# Altium schematic sheet 10_NTC_TEMPSENSOR.SchDoc
size 420 x 297 mm; SheetNumber: 17; SheetTotal: 28
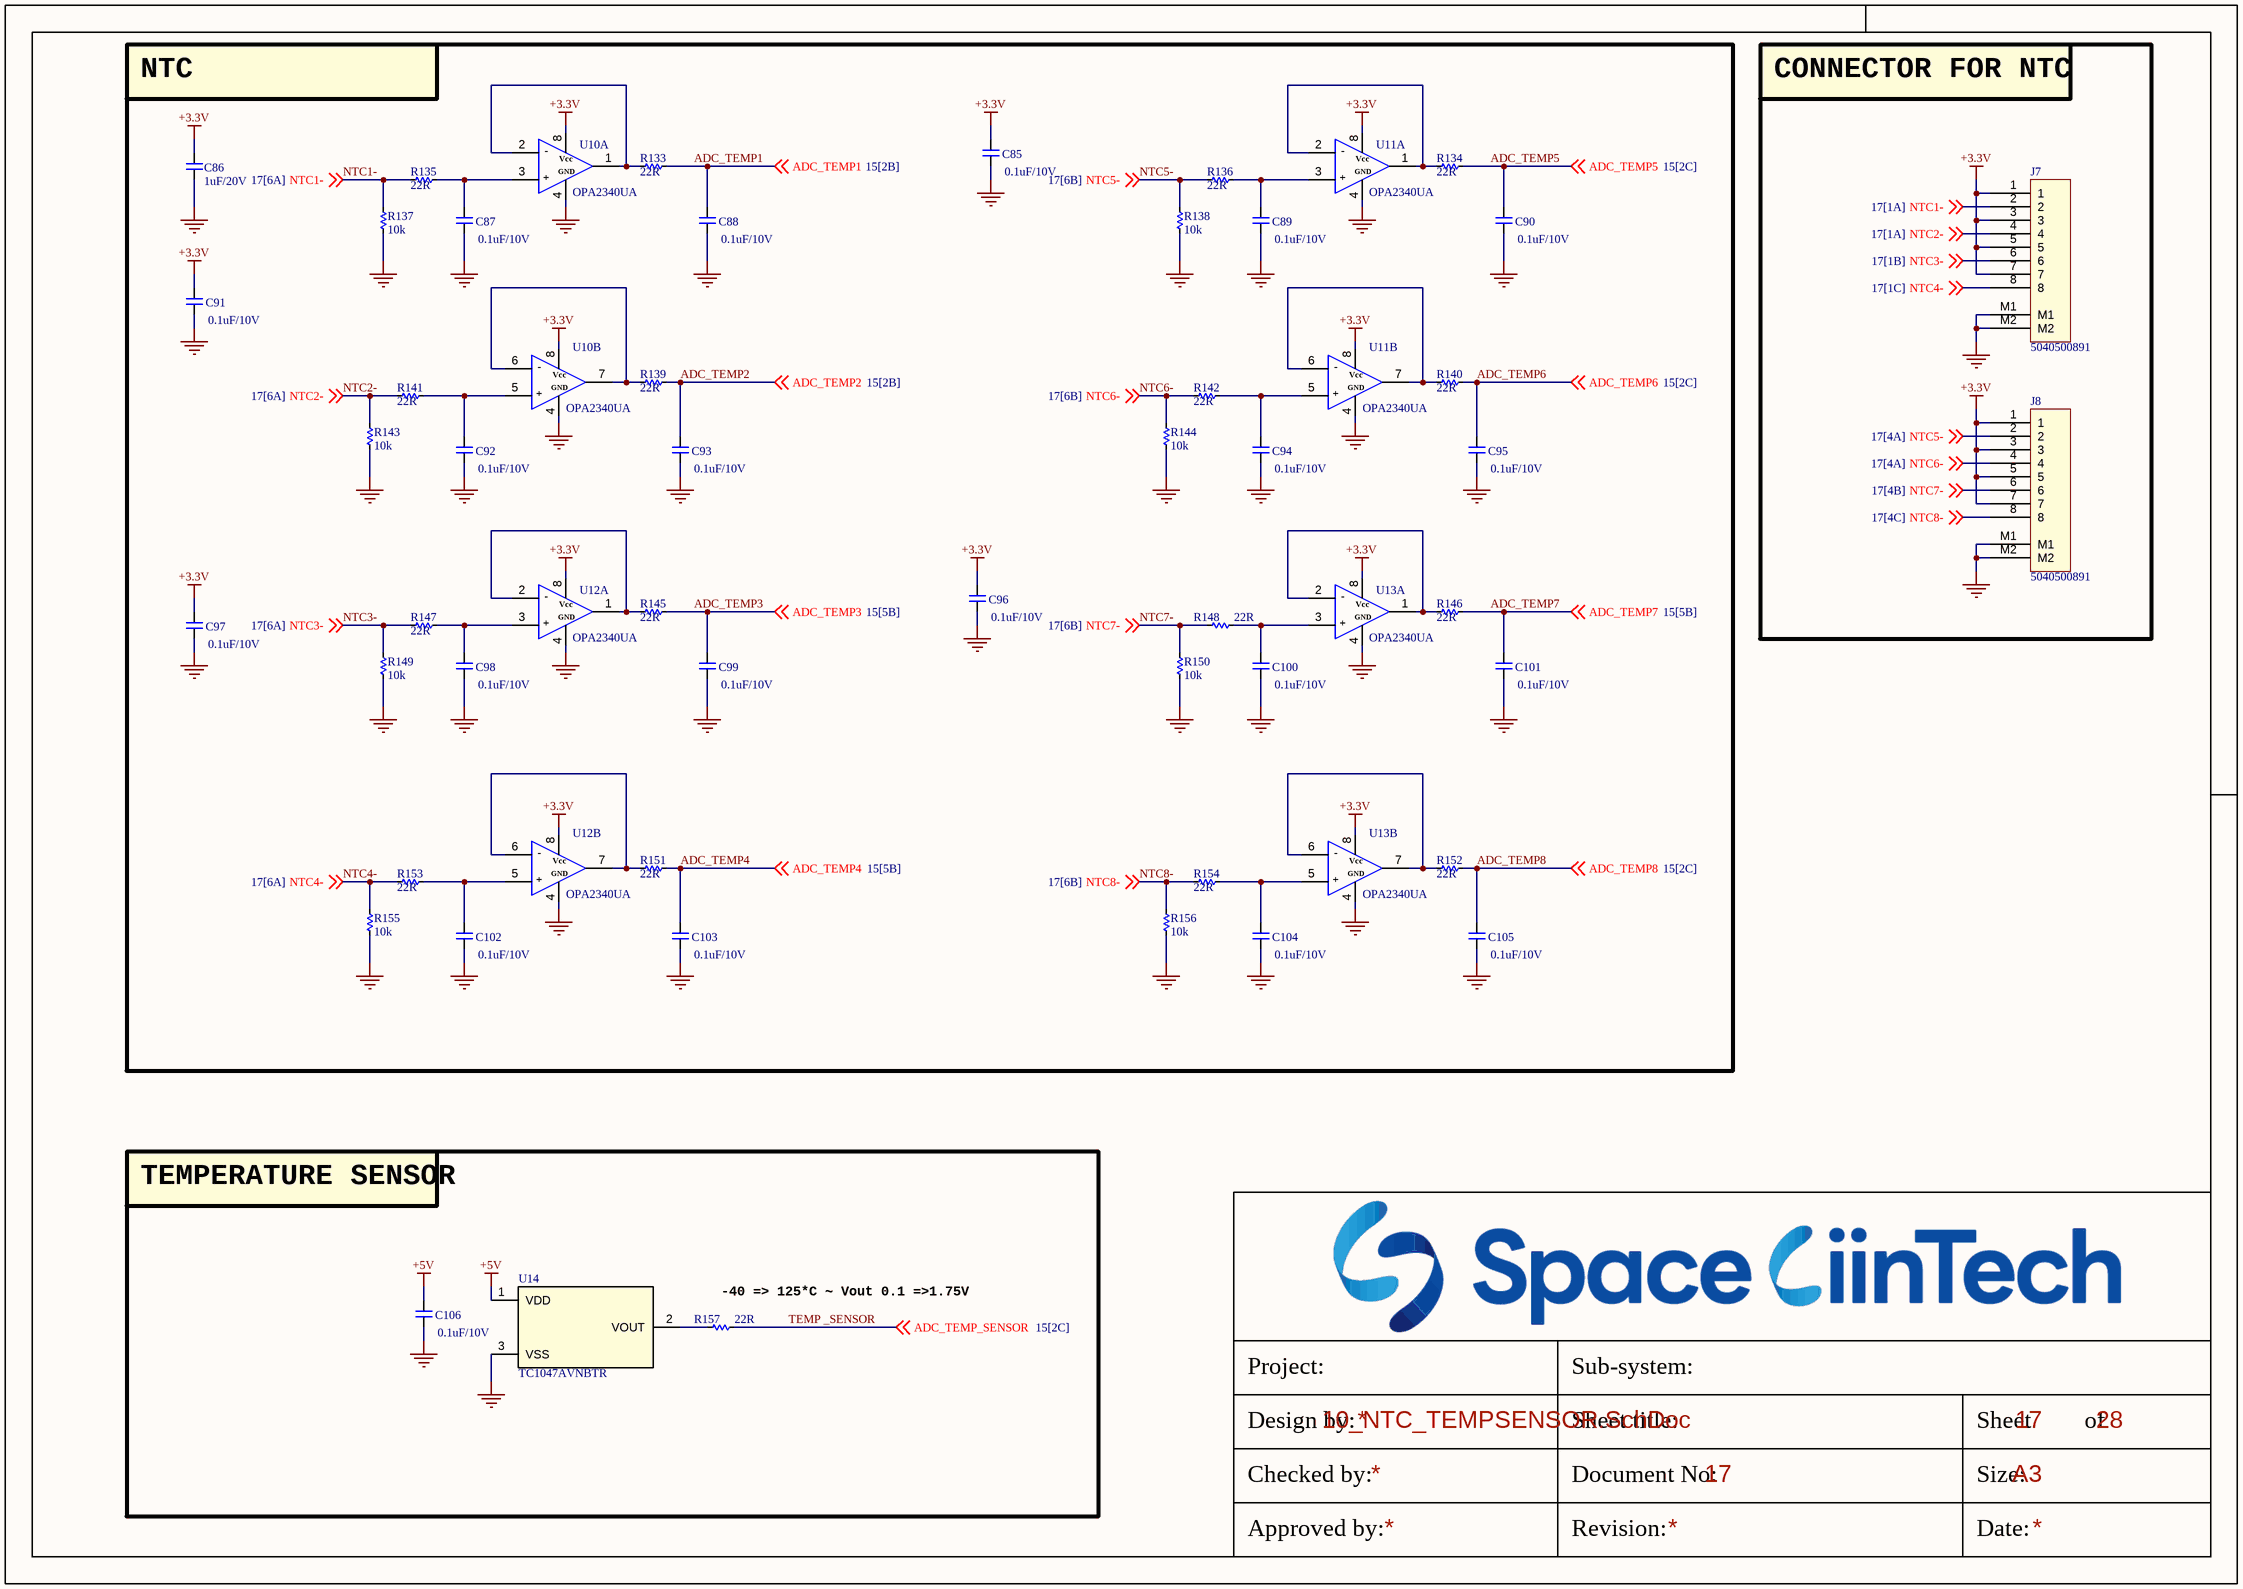
[diagram p0: 10_NTC_TEMPSENSOR.SchDoc]

## Parts
C85  0.1uF/10V  [CAP_C_1005X60]
C86  1uF/20V  [CAP_C_1005X60]
C87  0.1uF/10V  [CAP_C_1005X60]
C88  0.1uF/10V  [CAP_C_1005X60]
C89  0.1uF/10V  [CAP_C_1005X60]
C90  0.1uF/10V  [CAP_C_1005X60]
C91  0.1uF/10V  [CAP_C_1005X60]
C92  0.1uF/10V  [CAP_C_1005X60]
C93  0.1uF/10V  [CAP_C_1005X60]
C94  0.1uF/10V  [CAP_C_1005X60]
C95  0.1uF/10V  [CAP_C_1005X60]
C96  0.1uF/10V  [CAP_C_1005X60]
C97  0.1uF/10V  [CAP_C_1005X60]
C98  0.1uF/10V  [CAP_C_1005X60]
C99  0.1uF/10V  [CAP_C_1005X60]
C100  0.1uF/10V  [CAP_C_1005X60]
C101  0.1uF/10V  [CAP_C_1005X60]
C102  0.1uF/10V  [CAP_C_1005X60]
C103  0.1uF/10V  [CAP_C_1005X60]
C104  0.1uF/10V  [CAP_C_1005X60]
C105  0.1uF/10V  [CAP_C_1005X60]
C106  0.1uF/10V  [CAP_C_1005X60]
J7  5040500891  [MOLEX_5040500891]
J8  5040500891  [MOLEX_5040500891]
R133  22R  [RES_C_1005X40]
R134  22R  [RES_C_1005X40]
R135  22R  [RES_C_1005X40]
R136  22R  [RES_C_1005X40]
R137  10k  [RES_C_1005X40]
R138  10k  [RES_C_1005X40]
R139  22R  [RES_C_1005X40]
R140  22R  [RES_C_1005X40]
R141  22R  [RES_C_1005X40]
R142  22R  [RES_C_1005X40]
R143  10k  [RES_C_1005X40]
R144  10k  [RES_C_1005X40]
R145  22R  [RES_C_1005X40]
R146  22R  [RES_C_1005X40]
R147  22R  [RES_C_1005X40]
R148  22R  [RES_C_1005X40]
R149  10k  [RES_C_1005X40]
R150  10k  [RES_C_1005X40]
R151  22R  [RES_C_1005X40]
R152  22R  [RES_C_1005X40]
R153  22R  [RES_C_1005X40]
R154  22R  [RES_C_1005X40]
R155  10k  [RES_C_1005X40]
R156  10k  [RES_C_1005X40]
R157  22R  [RES_C_1005X40]
U10  OPA2340UA  [SOIC127P602X173-8N]  (parts A,B of 2)
U11  OPA2340UA  [SOIC127P602X173-8N]  (parts A,B of 2)
U12  OPA2340UA  [SOIC127P602X173-8N]  (parts A,B of 2)
U13  OPA2340UA  [SOIC127P602X173-8N]  (parts A,B of 2)
U14  TC1047AVNBTR  [SOT95P240X120-3N]

## Blocks framed on the sheet
NTC: C85-C105 R133-R156 U10-U13
CONNECTOR FOR NTC: J7 J8
TEMPERATURE SENSOR: C106 R157 U14

## Nets
+3.3V: C85.2 C86.2 C91.2 C96.2 C97.2 J7.1 J7.3 J7.5 J7.7 J8.1 J8.3 J8.5 J8.7 U10.8 U11.8 U12.8 U13.8
+5V: C106.2 U14.1(VDD)
GND: C85.1 C86.1 C87.1 C88.1 C89.1 C90.1 C91.1 C92.1 C93.1 C94.1 C95.1 C96.1 C97.1 C98.1 C99.1 C100.1 C101.1 C102.1 C103.1 C104.1 C105.1 C106.1 J7.M1 J7.M2 J8.M1 J8.M2 R137.1 R138.1 R143.1 R144.1 R149.1 R150.1 R155.1 R156.1 U10.4 U11.4 U12.4 U13.4 U14.3(VSS)
ADC_TEMP1: C88.2 R133.2 ; off-sheet ADC_TEMP1
ADC_TEMP2: C93.2 R139.2 ; off-sheet ADC_TEMP2
ADC_TEMP3: C99.2 R145.2 ; off-sheet ADC_TEMP3
ADC_TEMP4: C103.2 R151.2 ; off-sheet ADC_TEMP4
ADC_TEMP5: C90.2 R134.2 ; off-sheet ADC_TEMP5
ADC_TEMP6: C95.2 R140.2 ; off-sheet ADC_TEMP6
ADC_TEMP7: C101.2 R146.2 ; off-sheet ADC_TEMP7
ADC_TEMP8: C105.2 R152.2 ; off-sheet ADC_TEMP8
NTC1-: J7.2 R135.1 R137.2 ; off-sheet NTC1-
NTC2-: J7.4 R141.1 R143.2 ; off-sheet NTC2-
NTC3-: J7.6 R147.1 R149.2 ; off-sheet NTC3-
NTC4-: J7.8 R153.1 R155.2 ; off-sheet NTC4-
NTC5-: J8.2 R136.1 R138.2 ; off-sheet NTC5-
NTC6-: J8.4 R142.1 R144.2 ; off-sheet NTC6-
NTC7-: J8.6 R148.1 R150.2 ; off-sheet NTC7-
NTC8-: J8.8 R154.1 R156.2 ; off-sheet NTC8-
TEMP _SENSOR: R157.2 ; off-sheet ADC_TEMP_SENSOR  [also labelled ADC_TEMP_SENSOR]
NetC87_2: C87.2 R135.2 U10.3
NetC89_2: C89.2 R136.2 U11.3
NetC92_2: C92.2 R141.2 U10.5
NetC94_2: C94.2 R142.2 U11.5
NetC98_2: C98.2 R147.2 U12.3
NetC100_2: C100.2 R148.2 U13.3
NetC102_2: C102.2 R153.2 U12.5
NetC104_2: C104.2 R154.2 U13.5
NetR133_1: R133.1 U10.1 U10.2
NetR134_1: R134.1 U11.1 U11.2
NetR139_1: R139.1 U10.6 U10.7
NetR140_1: R140.1 U11.6 U11.7
NetR145_1: R145.1 U12.1 U12.2
NetR146_1: R146.1 U13.1 U13.2
NetR151_1: R151.1 U12.6 U12.7
NetR152_1: R152.1 U13.6 U13.7
NetR157_1: R157.1 U14.2(VOUT)

## Notes on the sheet
- (near R157) -40 => 125*C ~ Vout 0.1 =>1.75V
- Project:
- Sub-system:
- Design by:
- Sheet title:
- Sheet
- of
- Checked by:
- Approved by:
- Revision:
- Document No:
- Size:
- Date:
- A3
- (in symbol OPA2340UA, part A) -; Vcc; GND; +
- (in symbol OPA2340UA, part B) -; Vcc; GND; +

## Library data of the parts
C85-C106 = _CAP_C_2: CAP CHIP
J7 J8 = Header 8x1_2M
R133-R157 = _RES_B_2: RES
U14 = IC_SENSOR_TC1047AVNBTR: Temperature Sensor Analog, Local -40°C ~ 125°C 10mV/°C SOT-23-3